# EAGLE design klon (EAGLE 8.2.0)
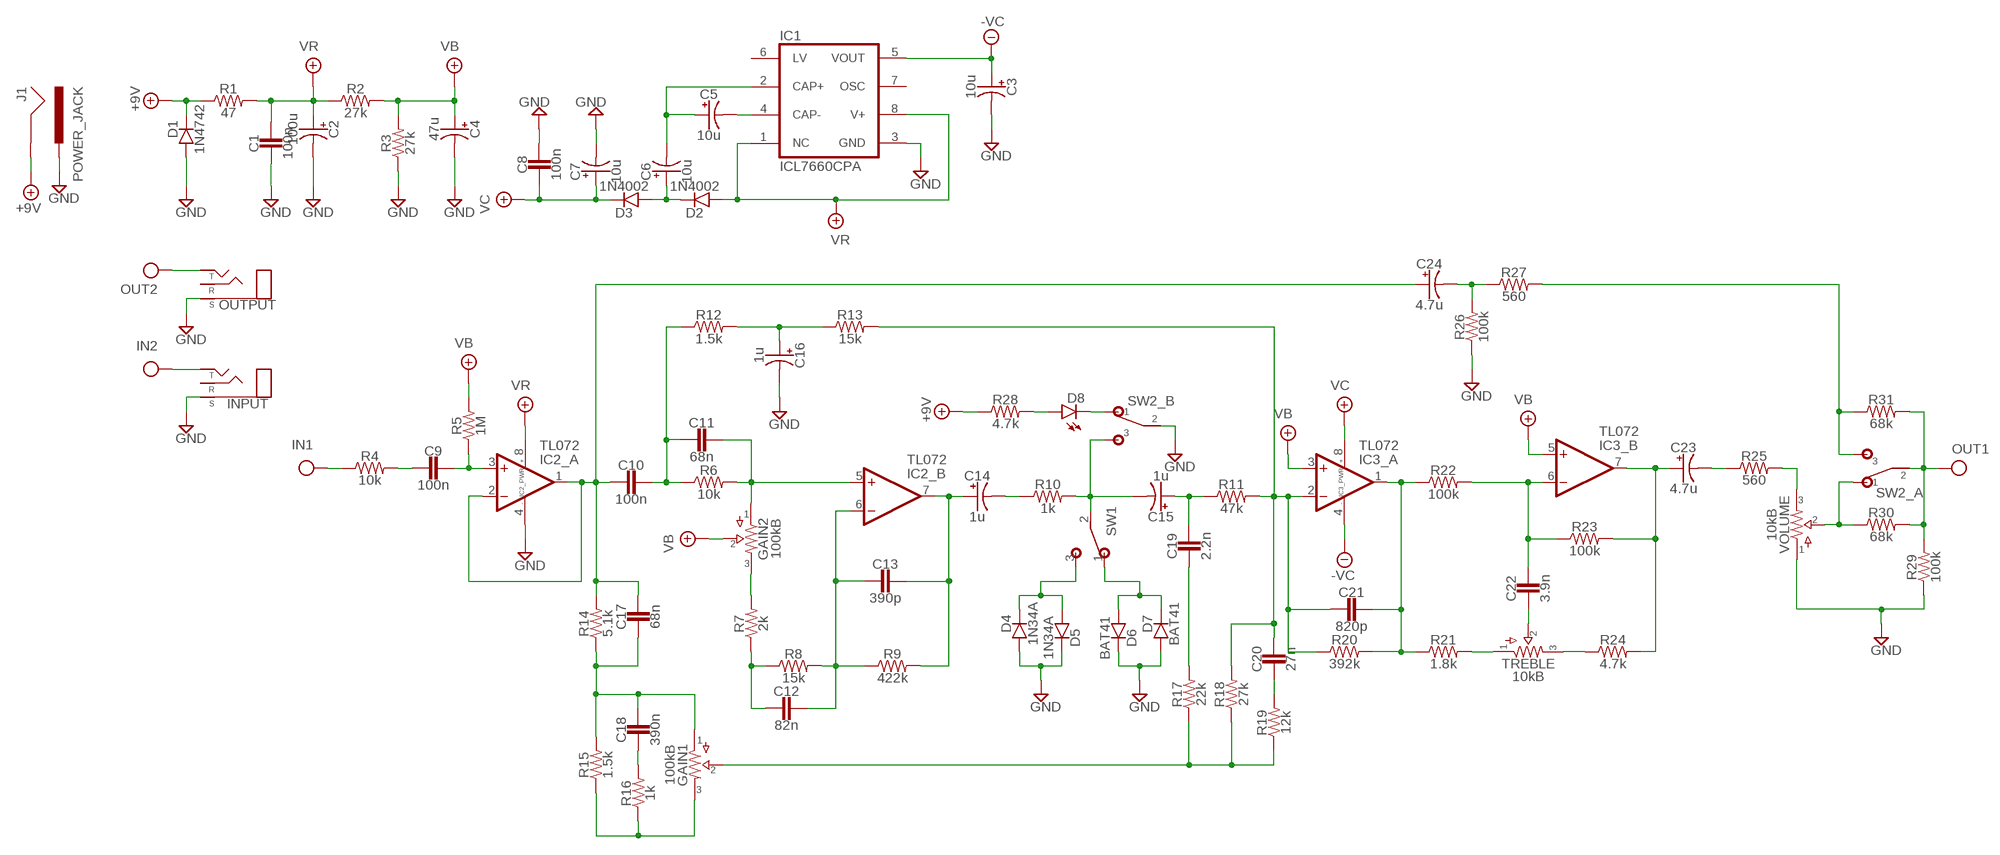
[diagram p0: schematic, sheet 1]

## Parts
C1  100n  CER/FILM2  [050X030_025_2]
C2  100u  0500  [050_020]
C3  10u  0500  [050_020]
C4  47u  0500  [050_020]
C5  10u  0500  [050_020]
C6  10u  0500  [050_020]
C7  10u  0500  [050_020]
C8  100n  CER/FILM2  [050X030_025_2]
C9  100n  CER/FILMBOX.1  [BOX_SMALL]
C10  100n  CER/FILMBOX.1  [BOX_SMALL]
C11  68n  CER/FILMBOX.1  [BOX_SMALL]
C12  82n  CER/FILMBOX.1  [BOX_SMALL]
C13  390p  CER/FILM2  [050X030_025_2]
C14  1u  0400  [040_020]
C15  1u  0400  [040_020]
C16  1u  0400  [040_020]
C17  68n  CER/FILMBOX.1  [BOX_SMALL]
C18  390n  CER/FILMBOX.2  [BOX_MED]
C19  2.2n  CER/FILMBOX.1  [BOX_SMALL]
C20  27n  CER/FILMBOX.1  [BOX_SMALL]
C21  820p  CER/FILM2  [050X030_025_2]
C22  3.9n  CER/FILMBOX.1  [BOX_SMALL]
C23  4.7u  0500  [050_020]
C24  4.7u  0500  [050_020]
D1  1N4742  DO41.2  [DO41-2]
D2  1N4002  DO41.2  [DO41-2]
D3  1N4002  DO41.2  [DO41-2]
D4  1N34A  DO35.2  [DO35-2]
D5  1N34A  DO35.2  [DO35-2]
D6  BAT41  DO35.2  [DO35-2]
D7  BAT41  DO35.2  [DO35-2]
D8  LEDA  [3MM_A]
GAIN1  100kB  POTS16MM  [16MM]
GAIN2  100kB  POTS16MM  [16MM]
IC1  ICL7660CPA  [DIL08]
IC2  TL072  DUALTH  [DIL0]
IC3  TL072  DUALTH  [DIL0]
INPUT  STEREONMJ  [NMJ6HCD2]
J1  POWER_JACK  [POWER_JACK_PTH]
OUTPUT  STEREONMJ  [NMJ6HCD2]
R1  47  R_.3B  [R0207/3]
R2  27k  R_.3B  [R0207/3]
R3  27k  R_.3B  [R0207/3]
R4  10k  R_.3B  [R0207/3]
R5  1M  R_.3B  [R0207/3]
R6  10k  R_.3B  [R0207/3]
R7  2k  R_.3B  [R0207/3]
R8  15k  R_.3B  [R0207/3]
R9  422k  R_.3B  [R0207/3]
R10  1k  R_.3B  [R0207/3]
R11  47k  R_.3B  [R0207/3]
R12  1.5k  R_.3B  [R0207/3]
R13  15k  R_.3B  [R0207/3]
R14  5.1k  R_.3B  [R0207/3]
R15  1.5k  R_.3B  [R0207/3]
R16  1k  R_.3B  [R0207/3]
R17  22k  R_.3B  [R0207/3]
R18  27k  R_.3B  [R0207/3]
R19  12k  R_.3B  [R0207/3]
R20  392k  R_.3B  [R0207/3]
R21  1.8k  R_.3B  [R0207/3]
R22  100k  R_.3B  [R0207/3]
R23  100k  R_.3B  [R0207/3]
R24  4.7k  R_.3B  [R0207/3]
R25  560  R_.3B  [R0207/3]
R26  100k  R_.3B  [R0207/3]
R27  560  R_.3B  [R0207/3]
R28  4.7k  R_.3B  [R0207/3]
R29  100k  R_.3B  [R0207/3]
R30  68k  R_.3B  [R0207/3]
R31  68k  R_.3B  [R0207/3]
SW1  SPDT  [M9040P]
SW2  DPDTPADS  [DPDT_PADS]
TREBLE  10kB  POTS16MM  [16MM]
VOLUME  10kB  POTS16MM  [16MM]

## Nets
+9V: D1.C J1.GND R1.1 R28.1
-VC: C3.+ IC1.5(VOUT) IC3.4(_PWR:V-)
GND: C1.2 C2.- C3.- C4.- C7.- C8.1 C16.- D1.A D4.A D5.C D6.C D7.A IC1.3(GND) IC2.4(_PWR:V-) INPUT.S J1.PWR OUTPUT.S R3.1 R26.1 R29.1 SW2.P$5 VOLUME.1
IN: INPUT.T R4.1
N$1: C9.2 R4.2
N$3: C5.- IC1.4(CAP-)
N$5: C5.+ C6.- IC1.2(CAP+)
N$6: C6.+ D2.C D3.A
N$7: C9.1 IC2.3(_A:+IN) R5.1
N$8: C10.2 C17.1 C24.+ IC2.1(_A:OUT) IC2.2(_A:-IN) R14.2
N$9: C10.1 C11.2 R6.1 R12.1
N$10: C11.1 GAIN2.1 IC2.5(_B:+IN) R6.2
N$11: D4.C D5.A SW1.3(S)
N$12: GAIN2.3 R7.2
N$13: C12.2 R7.1 R8.1
N$14: C12.1 C13.2 IC2.6(_B:-IN) R8.2 R9.1
N$15: D6.A D7.C SW1.1(O)
N$16: C13.1 C14.+ IC2.7(_B:OUT) R9.2
N$17: C15.+ C19.1 R11.1
N$18: C14.- R10.1
N$19: C15.- R10.2 SW1.2(P) SW2.P$6
N$20: C16.+ R12.2 R13.1
N$21: C21.1 IC3.1(_A:OUT) R20.2 R21.1 R22.1
N$22: C17.2 C18.1 GAIN1.1 R14.1 R15.2
N$23: GAIN1.3 R15.1 R16.1
N$24: C18.2 R16.2
N$25: GAIN1.2 R17.1 R18.1 R19.1
N$26: C19.2 R17.2
N$27: C20.1 C21.2 IC3.2(_A:-IN) R11.2 R13.2 R18.2 R20.1
N$28: C20.2 R19.2
N$29: R21.2 TREBLE.1
N$30: R24.1 TREBLE.3
N$31: C22.1 IC3.6(_B:-IN) R22.2 R23.1
N$32: C22.2 TREBLE.2
N$33: C23.+ IC3.7(_B:OUT) R23.2 R24.2
N$34: C24.- R26.2 R27.1
N$35: R27.2 R31.1 SW2.P$3
N$36: D8.K(C) SW2.P$4
N$37: D8.A R28.2
N$40: C23.- R25.1
N$41: R25.2 VOLUME.3
N$42: R30.1 SW2.P$1 VOLUME.2
OUT: OUTPUT.T R29.2 R30.2 R31.2 SW2.P$2
VB: C4.+ GAIN2.2 IC3.3(_A:+IN) IC3.5(_B:+IN) R2.2 R3.2 R5.2
VC: C7.+ C8.2 D3.C IC3.8(_PWR:V+)
VR: C1.1 C2.+ D2.A IC1.1(NC) IC1.8(V+) IC2.8(_PWR:V+) R1.2 R2.1
Unconnected: IC1.6(LV) IC1.7(OSC) INPUT.R OUTPUT.R

## Library data of the parts
C1 C8-C13 C17-C22 = pedals-capacitors-film:CER/FILM: 47 - 120pF Xicon Ceramic Disc 2.5mm lead spacing
C2-C7 C23 C24 = pedals-capacitors-elec:050
C14-C16 = pedals-capacitors-elec:040
D1-D3 = pedals-diodes:DO41: DO-41 Package Diodes: 1N4001 - 1N40019 Zener Diodes: 1N4728 - 1N4764
D4-D7 = pedals-diodes:DO35: DO-35 Package Diodes: 1N914
D8 = pedals-diodes:LED
GAIN1 GAIN2 TREBLE VOLUME = pedals-potentiometers:POTS
IC1 = pedals-integrated circuits:ICL7660CPA: VOLTAGE CONVERTER; MF: INTERSIL; MPN: ICL7660CPA; OC_FARNELL: 1018170; OC_NEWARK: 06F7441
IC2 IC3 = pedals-integrated circuits:DUAL: OP AMP
INPUT OUTPUT = pedals-jacks:STEREO
J1 = pedals-jacks:POWER_JACK: Power Jack Connector This is the standard 5.5mm barrel jack for power. The PTH is the most common, proven, reliable, footprint. The Slot footprint only works if the mill layer is transmitted to the PCB fab house so be warned. Here are the connectors we sell at SparkFun: DC Barrel Power Jack/Connector <https://www.sparkfun.com/products/119> (PRT-00119) DC Barrel Power Jack/Connector (SMD) <https://www.sparkfun.com/products/12748> (PRT-12748) DC Barrel Jack Adapter - Breadboard Compatible <https://www.sparkfun.com/products/10811> (PRT-10811) It is used on this SparkFun product (and many, many others): SparkFun RedBoard - Programmed with Arduino <https://www.sparkfun.com/products/12757> (DEV-12757) Also, if you need a mating power supply or connector, please check these out: Wall Adapter Power Supply - 9VDC 650mA <https://www.sparkfun.com/products/298> (TOL-00298) DC Barrel Jack Adapter - Male <https://www.sparkfun.com/products/10287> (PRT-10287); PROD_ID: CONN-08197
R1-R31 = pedals-resistors:R_
SW1 = pedals-switches:SPDT: TOGGLE SWITCH Marquardt
SW2 = pedals-switches:DPDT

## Board
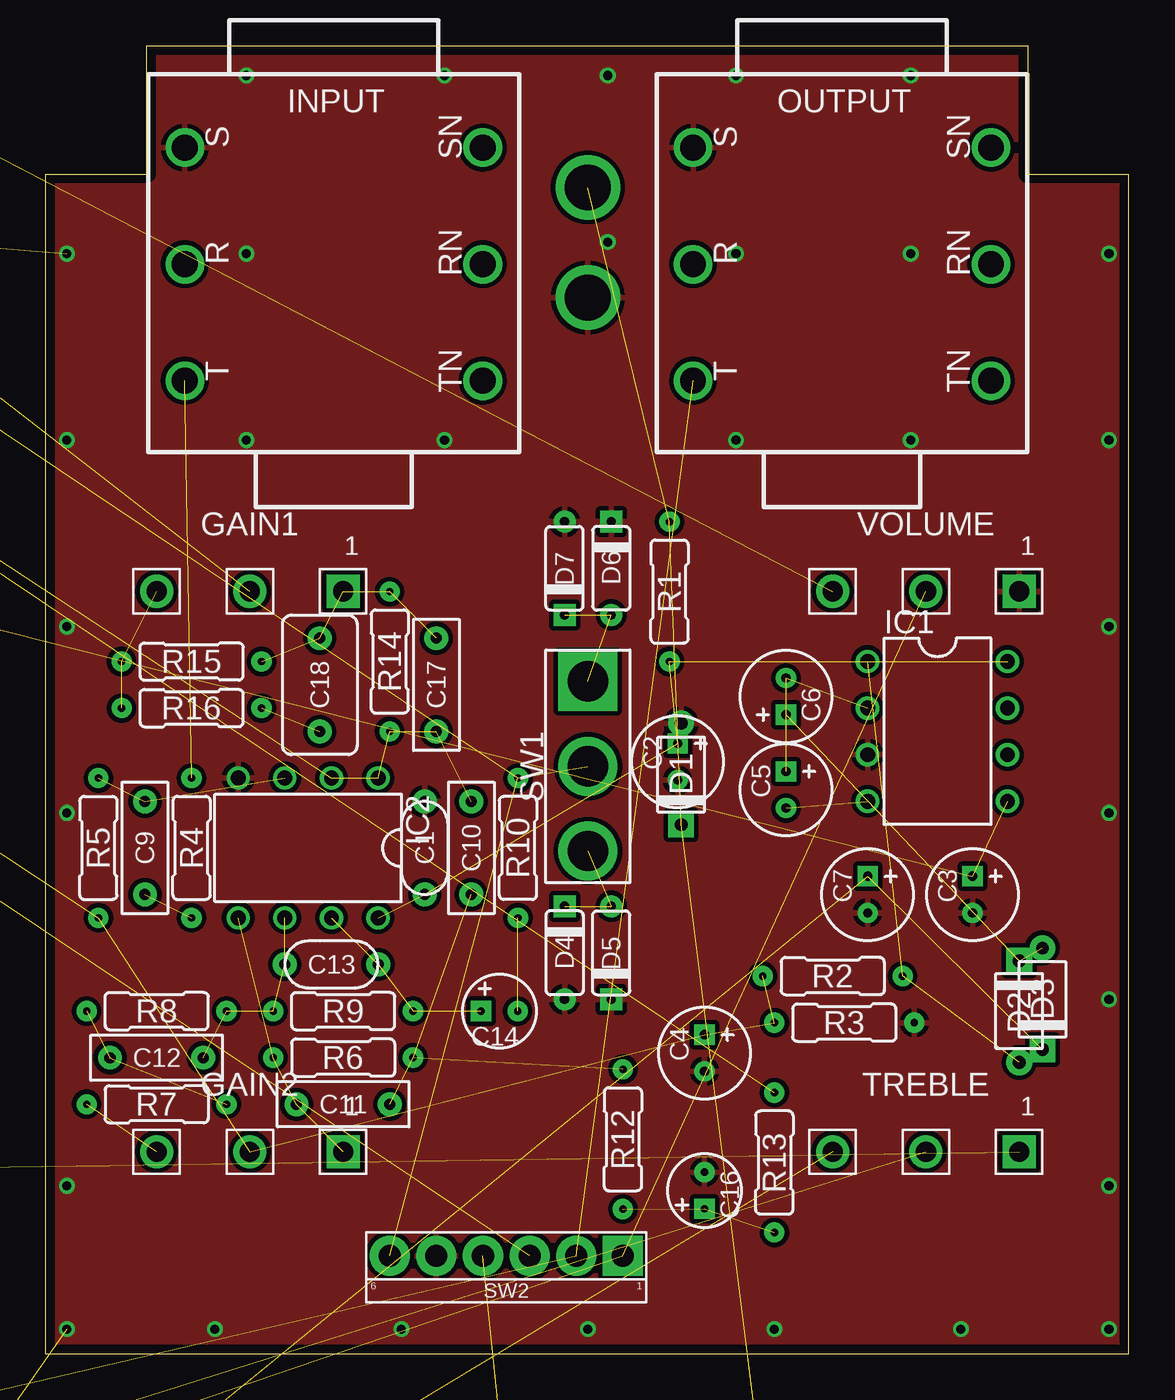
[diagram p1: board, top side]
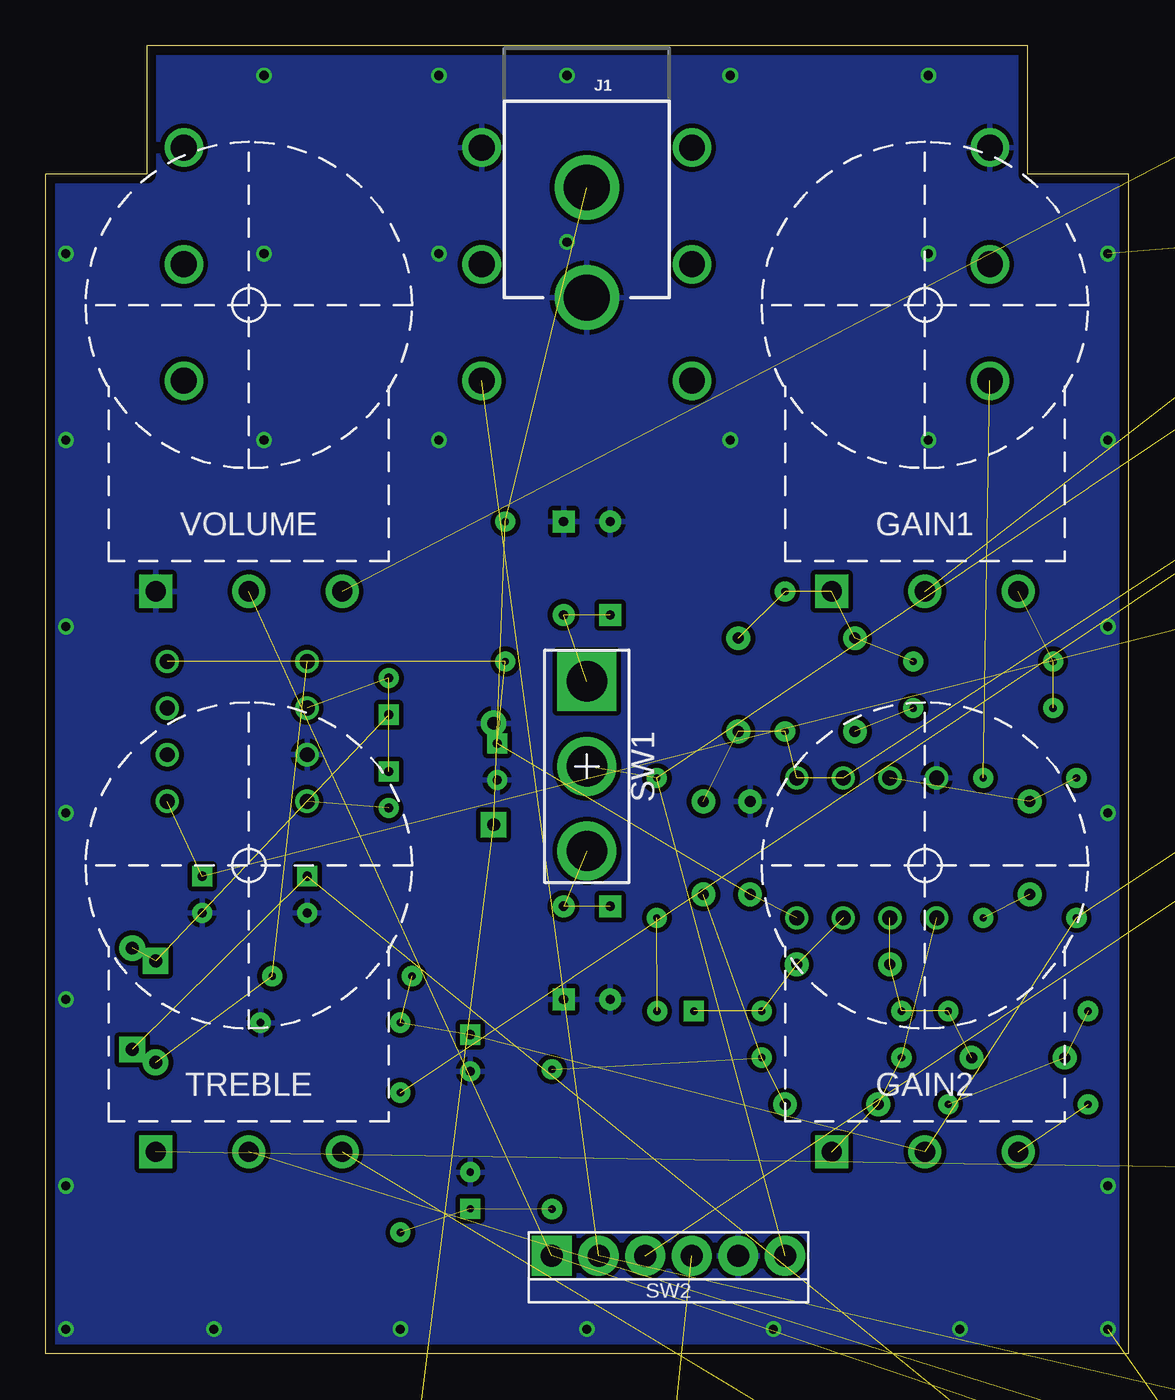
[diagram p2: board, bottom side, seen from below]

Size 59 x 71.27 mm. Coordinates in mm from the lower left corner, seen from the top.
Copper layers (1*16): Top 0.035mm / dielectric 1.6mm / Bottom 0.035mm
Design rules "Elecrow_2-layer_PCB_eagle_rule": minimum track width 6mil, minimum drill 12mil, track to track 6mil, track to pad 6mil, pad to pad 6mil, via to via 8mil, smd to smd 0mil, copper to edge 20mil, drill to drill 10mil, minimum pad ring 6mil, minimum via ring 6mil, stop-mask expansion 0mil, vias tented up to drill 100mil, thermal gap 10mil

### Footprints (pad centres in the part's own frame; a part is rotated, then mirrored left to right if it is on the bottom)
050X030_025_2 = drill 0.6 pad 1.3: 1 -2.54,0; 2 2.54,0
050_020 = drill 0.5 pad 1.1 square: + -0.998,0.001 | drill 0.5 pad 1.1: - 0.998,0.001
BOX_SMALL = drill 0.6 pad 1.3: 1 -2.54,0; 2 2.54,0
040_020 = drill 0.4 pad 1.1 square: + -1.001,0 | drill 0.4 pad 1.1: - 1.001,0
BOX_MED = drill 0.6 pad 1.3: 1 -2.54,0; 2 2.54,0
DO41-2 = drill 0.7 pad 1.4: A 2.794,0 | drill 0.7 pad 1.4 square: C -2.731,0
DO35-2 = drill 0.5 pad 1.2: A 2.54,0 | drill 0.5 pad 1.2 square: C -2.54,0
3MM_A = drill 1 pad 2 square: A -1.27,0 | drill 1 pad 2: K 1.27,0
16MM = drill 1.1 pad 1.8 square: 1 5.08,-1 | drill 1.1 pad 1.8: 2 0,-1; 3 -5.08,-1
DIL08 = drill 0.813 pad 1.27: 1 -3.81,-3.81; 2 -1.27,-3.81; 3 1.27,-3.81; 4 3.81,-3.81; 5 3.81,3.81; 6 1.27,3.81; 7 -1.27,3.81; 8 -3.81,3.81
DIL0 = drill 0.813 pad 1.27: 1 -3.81,-3.81; 2 -1.27,-3.81; 3 1.27,-3.81; 4 3.81,-3.81; 5 3.81,3.81; 6 1.27,3.81; 7 -1.27,3.81; 8 -3.81,3.81
NMJ6HCD2 = drill 1.4: R 0,8.115; RN 0,-8.115; S 6.35,8.115; SN 6.35,-8.115; T -6.35,8.115; TN -6.35,-8.115
POWER_JACK_PTH = drill 2.5: GND 0,7.7; PWR 0,13.7
R0207/3 = drill 0.4 pad 1.1: 1 -3.81,0; 2 3.81,0
M9040P = drill 2.2 pad 2.9 square: 1 4.636,0 | drill 2.2 pad 2.9: 2 0,0; 3 -4.61,0
DPDT_PADS = drill 1.2 pad 2.184 square: P$1 -6.35,0 | drill 1.2 pad 2.184: P$2 -3.81,0; P$3 -1.27,0; P$4 1.27,0; P$5 3.81,0; P$6 6.35,0

### Placement (x,y rotation side)
C1  20.64,27.56 90 top
C2  34.42,32.26 270 top
C3  50.48,25.02 270 top
C4  35.88,16.38 270 top
C5  40.32,30.73 270 top
C6  40.32,35.81 90 top
C7  44.77,25.02 270 top
C8  -7.3,-14.35 0 top  (outside the outline)
C9  5.4,27.56 270 top
C10  23.18,27.56 90 top
C11  16.19,13.59 0 top
C12  6.03,16.13 180 top
C13  15.56,21.21 180 top
C14  24.7,18.67 0 top
C15  -20.64,61.85 0 top  (outside the outline)
C16  35.88,8.89 90 top
C17  21.27,36.45 90 top
C18  14.92,36.45 270 top
C19  -33.34,113.92 0 top  (outside the outline)
C20  -33.34,66.93 0 top  (outside the outline)
C21  -33.34,21.84 0 top  (outside the outline)
C22  -33.34,-13.72 0 top  (outside the outline)
C23  -35.88,-48.64 0 top  (outside the outline)
C24  -51.12,75.82 0 top  (outside the outline)
D1  34.61,31.56 90 top
D2  53.02,18.67 270 top
D3  54.29,19.3 90 top
D4  28.26,21.84 270 top
D5  30.8,21.84 90 top
D6  30.8,42.8 270 top
D7  28.26,42.8 90 top
D8  25.08,-19.43 0 top  (outside the outline)
GAIN1  11.11,42.55 0 top
GAIN2  11.11,12 0 top
IC1  48.58,33.91 270 top
IC2  14.29,27.56 180 top
IC3  -32.07,49.78 0 top  (outside the outline)
INPUT  15.68,59.37 90 top
J1  29.53,71.25 180 bottom
OUTPUT  43.37,59.37 90 top
R1  33.97,41.53 270 top
R2  42.86,20.57 180 top
R3  43.5,18.03 180 top
R4  7.94,27.56 270 top
R5  2.86,27.56 270 top
R6  16.19,16.13 180 top
R7  6.03,13.59 180 top
R8  6.03,18.67 0 top
R9  16.19,18.67 0 top
R10  25.72,27.56 90 top
R11  -18.1,50.42 0 top  (outside the outline)
R12  31.43,11.68 270 top
R13  39.69,10.41 90 top
R14  18.73,37.72 270 top
R15  7.94,37.72 0 top
R16  7.94,35.18 0 top
R17  -33.34,101.85 0 top  (outside the outline)
R18  -33.34,90.42 0 top  (outside the outline)
R19  -33.34,78.99 0 top  (outside the outline)
R20  -33.34,33.91 0 top  (outside the outline)
R21  -33.34,9.78 0 top  (outside the outline)
R22  -33.34,-1.65 0 top  (outside the outline)
R23  -33.34,-25.78 0 top  (outside the outline)
R24  -33.34,-37.21 0 top  (outside the outline)
R25  -48.58,87.25 0 top  (outside the outline)
R26  -48.58,64.39 0 top  (outside the outline)
R27  -48.58,52.96 0 top  (outside the outline)
R28  44.13,-16.89 0 top  (outside the outline)
R29  -48.58,-11.81 0 top  (outside the outline)
R30  -48.58,-23.24 0 top  (outside the outline)
R31  -48.58,-34.67 0 top  (outside the outline)
SW1  29.53,32 90 top
SW2  25.08,5.33 180 top
TREBLE  47.94,12 0 top
U$1  [125B_PCB]  0,1.27 0 top
VOLUME  47.94,42.55 0 top

### Tracks (layer width: path | path; a pad name or v marks a point on that pad's centre or on a via)
+9V  (3 unrouted)
-VC  (2 unrouted)
GND  (via drill 0.5 pad 0.85)  (3 unrouted)
  other vias: 57.91,59.94 57.91,49.78 10.92,69.66 21.72,69.66 30.61,69.66 1.14,49.78 10.92,59.94 10.92,49.78 21.72,49.78 30.61,60.58 37.59,69.66 47.12,69.66 37.59,59.94 37.59,49.78 47.12,59.94 47.12,49.78 57.91,39.62 57.91,29.46 57.91,19.3 57.91,9.14 57.91,1.33 49.85,1.33 39.69,1.33 29.53,1.33 19.37,1.33 9.21,1.33 1.14,1.33 1.14,59.94 1.14,39.62 1.14,29.46 1.14,9.14
  pour Bottom (isolate 0.254): 0.32,70.74 58.74,70.74 58.74,-1.02 0.32,-1.02
  pour Top (isolate 0.254): 0.32,-0.38 59.37,-0.38 59.37,72.01 -0.32,72.01 -0.32,-0.38
IN  (1 unrouted)
N$1  (1 unrouted)
N$3  (1 unrouted)
N$5  (2 unrouted)
N$6  (2 unrouted)
N$7  (2 unrouted)
N$8  (5 unrouted)
N$9  (3 unrouted)
N$10  (3 unrouted)
N$11  (2 unrouted)
N$12  (1 unrouted)
N$13  (2 unrouted)
N$14  (4 unrouted)
N$15  (2 unrouted)
N$16  (3 unrouted)
N$17  (2 unrouted)
N$18  (1 unrouted)
N$19  (3 unrouted)
N$20  (2 unrouted)
N$21  (4 unrouted)
N$22  (4 unrouted)
N$23  (2 unrouted)
N$24  (1 unrouted)
N$25  (3 unrouted)
N$26  (1 unrouted)
N$27  (6 unrouted)
N$28  (1 unrouted)
N$29  (1 unrouted)
N$30  (1 unrouted)
N$31  (3 unrouted)
N$32  (1 unrouted)
N$33  (3 unrouted)
N$34  (2 unrouted)
N$35  (2 unrouted)
N$36  (1 unrouted)
N$37  (1 unrouted)
N$40  (1 unrouted)
N$41  (1 unrouted)
N$42  (2 unrouted)
OUT  (4 unrouted)
VB  (6 unrouted)
VC  (3 unrouted)
VR  (7 unrouted)